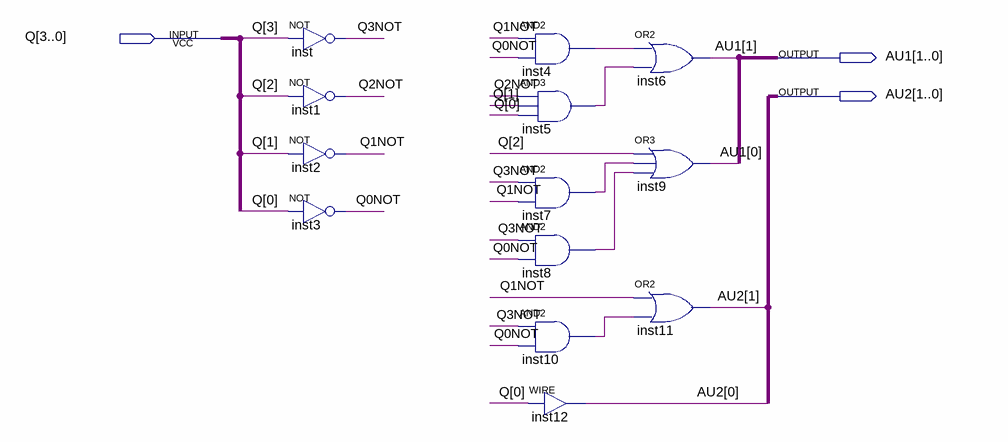
[diagram p0: schematic sheet]
// Quartus schematic DECODE_AU.bdf as structural Verilog: 13 symbols, 3 pins
module DECODE_AU (
  input  [3:0] Q,
  output [1:0] AU1,
  output [1:0] AU2
);

  wire inst4_out, inst5_out, inst7_out, inst8_out, inst10_out, Q0NOT, Q1NOT, Q2NOT, Q3NOT;

  not inst (Q3NOT, Q[3]);
  not inst1 (Q2NOT, Q[2]);
  not inst2 (Q1NOT, Q[1]);
  not inst3 (Q0NOT, Q[0]);
  and inst4 (inst4_out, Q1NOT, Q0NOT);
  and inst5 (inst5_out, Q2NOT, Q[1], Q[0]);
  and inst7 (inst7_out, Q3NOT, Q1NOT);
  and inst8 (inst8_out, Q3NOT, Q0NOT);
  and inst10 (inst10_out, Q3NOT, Q0NOT);
  assign AU2[0] = Q[0];  // WIRE inst12
  or inst6 (AU1[1], inst4_out, inst5_out);
  or inst9 (AU1[0], Q[2], inst7_out, inst8_out);
  or inst11 (AU2[1], Q1NOT, inst10_out);
endmodule
